# EAGLE design Schematic1 (EAGLE 6.5.0)
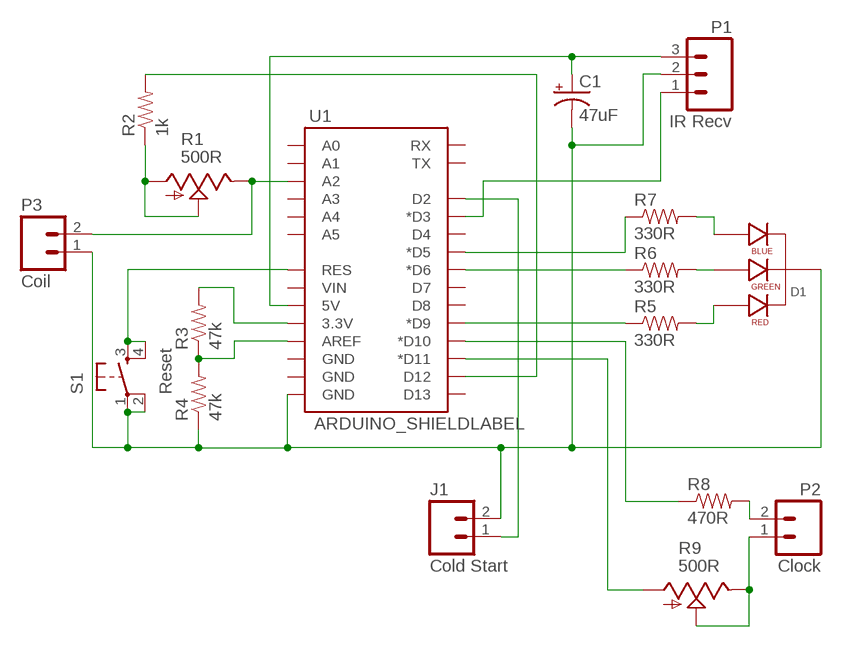
[diagram p0: schematic, sheet 1]

## Parts
C1  47uF  CAP_POLPTH2  [CPOL-RADIAL-10UF-25V]
D1  LED-RGB-CC-THRUDIFFUSE  [LED-RGB-THRU]
J1  Cold Start  M02PTH  [1X02]
P1  IR Recv  M03PTH  [1X03]
P2  Clock  M02PTH  [1X02]
P3  Coil  M02PTH  [1X02]
R1  500R  TRIM_US-ECP10P  [ECP10P]
R2  1k  10KOHM1/6W5%(PTH)KIT  [AXIAL-0.3-KIT]
R3  47k  10KOHM1/6W5%(PTH)KIT  [AXIAL-0.3-KIT]
R4  47k  10KOHM1/6W5%(PTH)KIT  [AXIAL-0.3-KIT]
R5  330R  10KOHM1/6W5%(PTH)KIT  [AXIAL-0.3-KIT]
R6  330R  10KOHM1/6W5%(PTH)KIT  [AXIAL-0.3-KIT]
R7  330R  10KOHM1/6W5%(PTH)KIT  [AXIAL-0.3-KIT]
R8  470R  10KOHM1/6W5%(PTH)KIT  [AXIAL-0.3-KIT]
R9  500R  TRIM_US-ECP10P  [ECP10P]
S1  Reset  TAC_SWITCHPTH  [TACTILE-PTH]
U1  ARDUINO_SHIELDLABEL  [DUEMILANOVE_SHIELD]

## Nets
GND: C1.2(-) D1.2(CATHODE) J1.2 P1.2 P3.1 R4.P$1 S1.1 S1.2 U1.GND@0(GND)
N$1: R5.P$1 U1.D9(*D9)
N$2: R6.P$1 U1.D6(*D6)
N$3: D1.4(BLUE_ANODE) R7.P$2
N$4: R7.P$1 U1.D5(*D5)
N$5: D1.3(GREEN_ANODE) R6.P$2
N$6: D1.1(RED_ANODE) R5.P$2
N$8: J1.1 U1.D2
N$9: P3.2 R1.E U1.A2
N$10: R2.P$2 U1.D12
N$11: R3.P$1 R4.P$2 U1.AREF
N$12: R3.P$2 U1.3.3V
N$13: R1.A R1.S R2.P$1
N$14: S1.3 S1.4 U1.RES
N$15: C1.1(+) P1.3 U1.5V
N$16: P1.1 U1.D3(*D3)
N$17: R8.P$1 U1.D10(*D10)
N$18: R9.A U1.D11(*D11)
N$19: P2.2 R8.P$2
N$20: P2.1 R9.E R9.S
Unconnected: U1.A0 U1.A1 U1.A3 U1.A4 U1.A5 U1.D4 U1.D7 U1.D8 U1.D13 U1.GND@1(GND) U1.GND@2(GND) U1.RX U1.TX U1.VIN

## Library data of the parts
C1 = SparkFun-Capacitors:CAP_POL: Capacitor Polarized These are standard SMD and PTH capacitors. Normally 10uF, 47uF, and 100uF in electrolytic and tantalum varieties. Always verify the external diameter of the through hole cap, it varies with capacity, voltage, and manufacturer. The EIA devices should be standard.
D1 = dehne:LED-RGB-CC-THRU: RGB Through-hole common cathode LED wide spacing for hand soldering; PROD_ID: DIO-09434
J1 P2 P3 = SparkFun-Connectors:M02: Standard 2-pin 0.1" header. Use with - straight break away headers ( PRT-00116) - right angle break away headers (PRT-00553) - swiss pins (PRT-00743) - machine pins (PRT-00117) - female headers (PRT-00115) Molex polarized connector foot print use with: PRT-08233 with associated crimp pins and housings. 2.54_SCREWTERM for use with PRT-10571. 3.5mm Screw Terminal footprints for PRT-08084 5mm Screw Terminal footprints for use with PRT-08433
P1 = SparkFun-Connectors:M03: Header 3 Standard 3-pin 0.1" header. Use with straight break away headers (SKU : PRT-00116), right angle break away headers (PRT-00553), swiss pins (PRT-00743), machine pins (PRT-00117), and female headers (PRT-00115). Molex polarized connector foot print use with SKU : PRT-08232 with associated crimp pins and housings.
R1 R9 = pot:TRIM_US-: POTENTIOMETER
R2-R8 = SparkFun-Resistors:10KOHM1/6W5%(PTH): RES-08375; PROD_ID: RES-08375
S1 = SparkFun-Electromechanical:TAC_SWITCH: Momentary Switch Button commonly used for reset or general input. Spark Fun Electronics SKU : COM-00097 SMT- SWCH-08247
U1 = SparkFun-Boards:ARDUINO_SHIELD: Arduino shield footprint

## Board
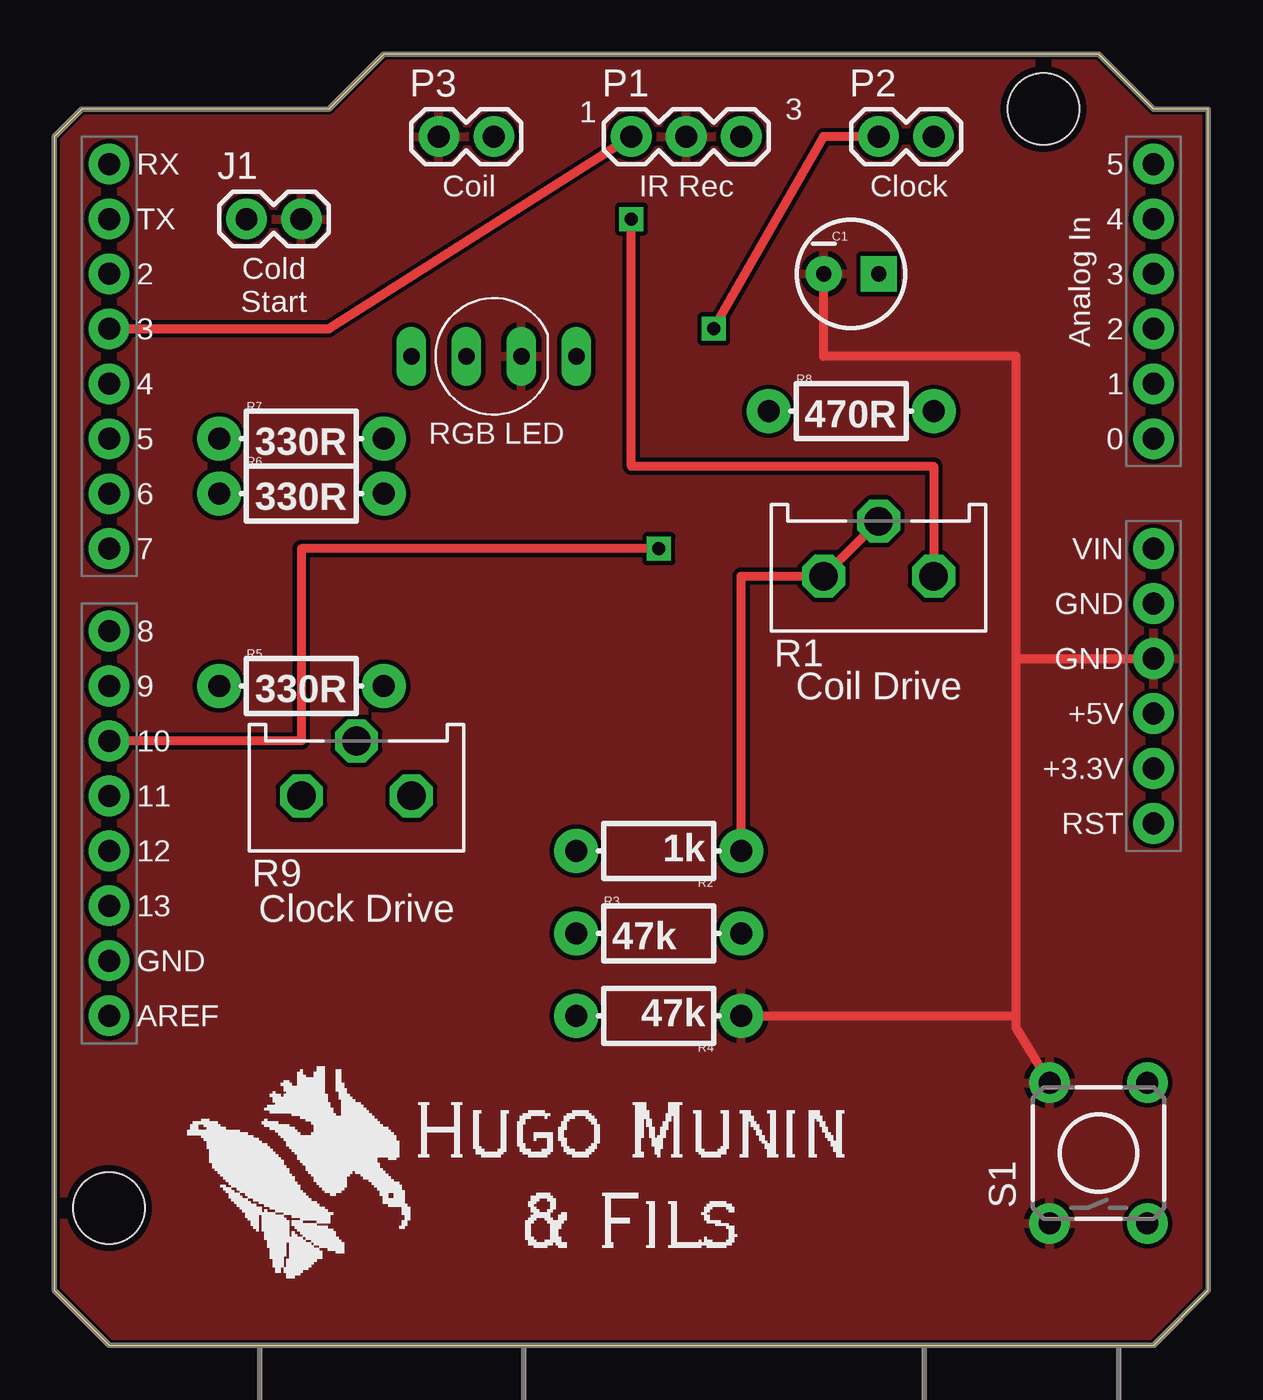
[diagram p1: board, top side]
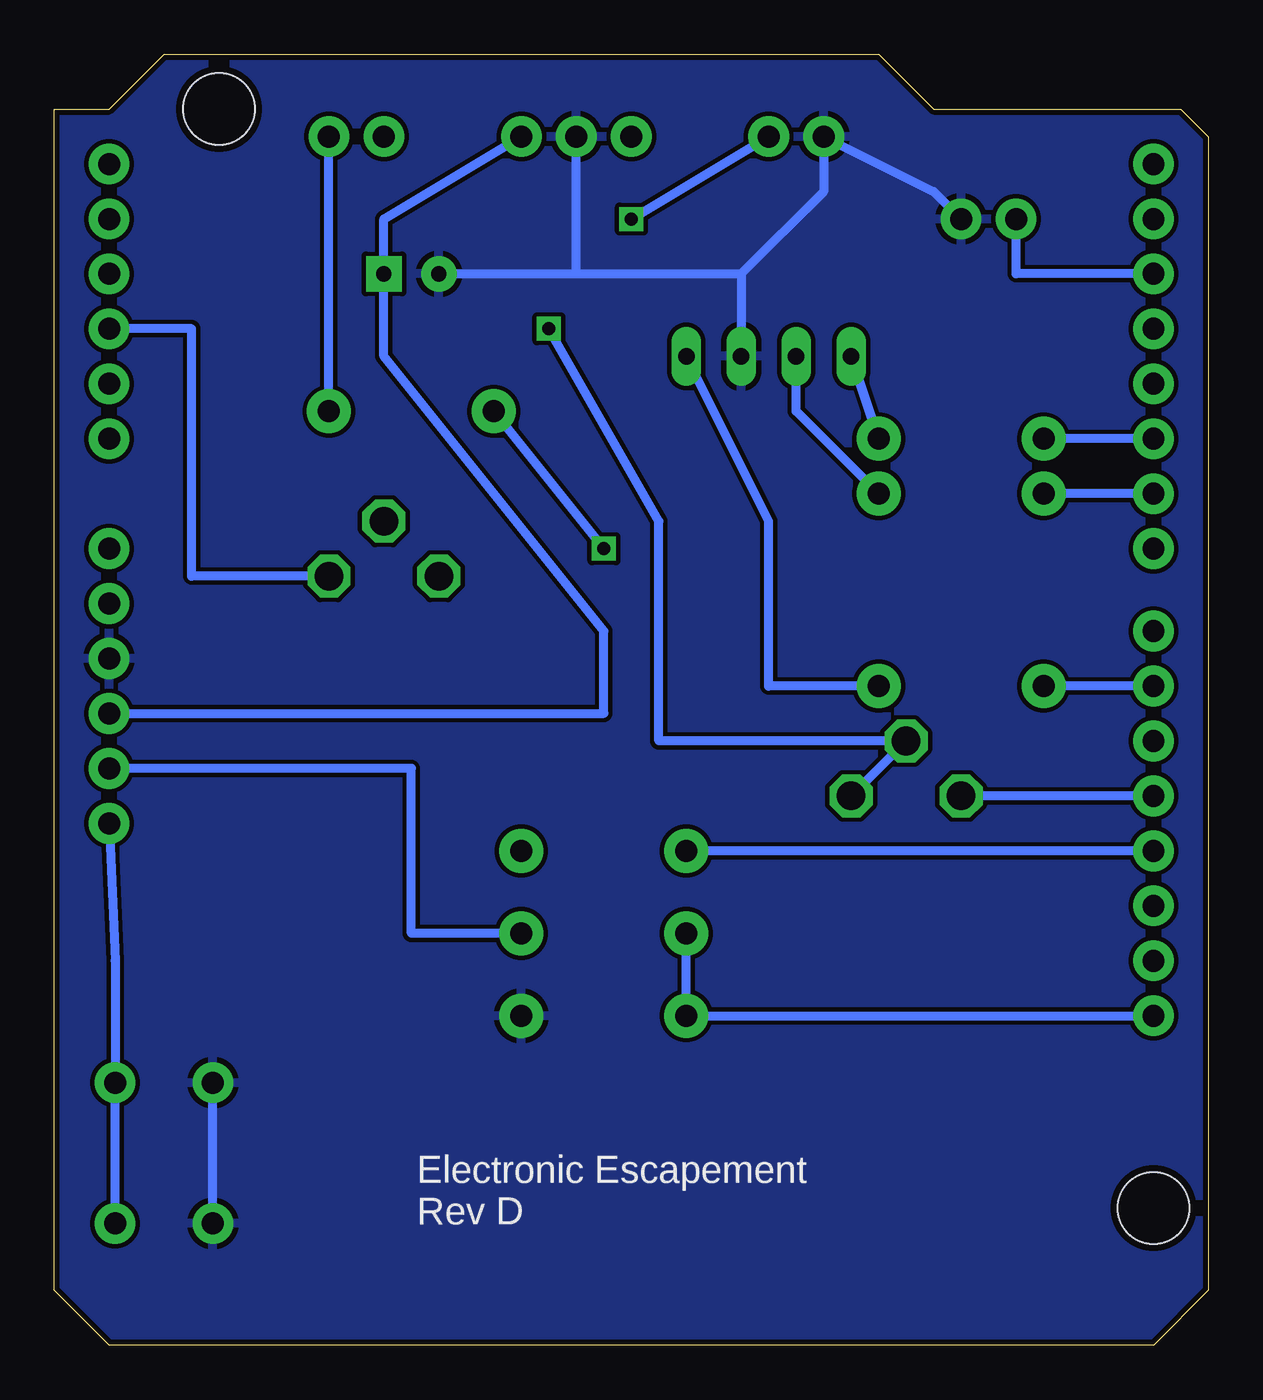
[diagram p2: board, bottom side, seen from below]

Size 53.34 x 59.69 mm. Coordinates in mm from the lower left corner, seen from the top.
Outline: 0,2.54 2.54,0 50.8,0 53.34,2.54 53.34,57.15 50.8,57.15 48.26,59.69 15.24,59.69 12.7,57.15 1.27,57.15 0,55.88 0,2.54
Copper layers (1*16): Top 0.035mm / dielectric 1.5mm / Bottom 0.035mm
Design rules "SparkFun": minimum track width 8mil, minimum drill 20mil, track to track 8mil, track to pad 8mil, pad to pad 8mil, via to via 8mil, smd to smd 8mil, copper to edge 10mil, drill to drill 8mil, minimum pad ring 12mil, minimum via ring 10mil, stop-mask expansion 4mil, vias tented up to drill 25mil, thermal gap 10mil

### Footprints (pad centres in the part's own frame; a part is rotated, then mirrored left to right if it is on the bottom)
CPOL-RADIAL-10UF-25V = drill 0.7 pad 1.651 square: 1 1.27,0 | drill 0.7 pad 1.651: 2 -1.27,0
LED-RGB-THRU = drill 0.762 pad 0.889 long: 1 3.81,0; 2 1.27,0; 3 -1.27,0; 4 -3.81,0
1X02 = drill 1.016 pad 1.88: 1 0,0; 2 2.54,0
1X03 = drill 1.016 pad 1.88: 1 0,0; 2 2.54,0; 3 5.08,0
ECP10P = drill 1.321 octagon: A -2.54,0; E 2.54,0; S 0,2.54
AXIAL-0.3-KIT = drill 1.016 pad 2.032: P$1 -3.81,0; P$2 3.81,0
TACTILE-PTH = drill 1.016 pad 1.88: 1 -3.251,2.261; 2 3.251,2.261; 3 -3.251,-2.261; 4 3.251,-2.261
DUEMILANOVE_SHIELD = drill 1.016 pad 1.88: 3.3V 50.8,26.67; 5V 50.8,29.21; A0 50.8,41.91; A1 50.8,44.45; A2 50.8,46.99; A3 50.8,49.53; A4 50.8,52.07; A5 50.8,54.61; AREF 2.54,15.24; D2 2.54,49.53; D3 2.54,46.99; D4 2.54,44.45; D5 2.54,41.91; D6 2.54,39.37; D7 2.54,36.83; D8 2.54,33.02; D9 2.54,30.48; D10 2.54,27.94; D11 2.54,25.4; D12 2.54,22.86; D13 2.54,20.32; GND@0 50.8,31.75; GND@1 50.8,34.29; GND@2 2.54,17.78; RES 50.8,24.13; RX 2.54,54.61; TX 2.54,52.07; VIN 50.8,36.83 | hole 3.302: 45.72,57.15; 2.54,6.35

### Placement (x,y rotation side)
C1  36.83,49.53 0 top
D1  20.32,45.72 0 top
J1  8.89,52.07 0 top
P1  26.67,55.88 0 top
P2  38.1,55.88 0 top
P3  17.78,55.88 0 top
R1  38.1,35.56 0 top
R2  27.94,22.86 180 top
R3  27.94,19.05 0 top
R4  27.94,15.24 180 top
R5  11.43,30.48 0 top
R6  11.43,39.37 0 top
R7  11.43,41.91 0 top
R8  36.83,43.18 0 top
R9  13.97,25.4 0 top
S1  48.26,8.89 90 top
U1  0,0 0 top

### Tracks (layer width: path | path; a pad name or v marks a point on that pad's centre or on a via)
GND
  Top 0.406: S1.2 44.45,14.68 44.45,15.24 | 44.45,15.24 44.45,31.75 | 44.45,31.75 U1.GND@0 | R4.P$1 44.45,15.24 | 44.45,31.75 44.45,45.72 35.56,45.72 C1.2
  Bottom 0.406: J1.2 12.7,53.34 P3.1 17.78,53.34 21.59,49.53 | S1.1 S1.2 | C1.2 29.21,49.53 | 29.21,49.53 P1.2 | 21.59,49.53 D1.2 | 29.21,49.53 21.59,49.53
  pour Top: 50.8,0 2.54,0 0,2.54 0,55.88 1.27,57.15 12.7,57.15 15.24,59.69 48.26,59.69 50.8,57.15 53.34,57.15 53.34,2.54
  pour Bottom: 50.8,0 2.54,0 0,2.54 0,55.88 1.27,57.15 12.7,57.15 15.24,59.69 48.26,59.69 50.8,57.15 53.34,57.15 53.34,2.54
N$1
  Bottom 0.406: U1.D9 R5.P$1
N$2
  Bottom 0.406: U1.D6 R6.P$1
N$3
  Bottom 0.406: R7.P$2 D1.4
N$4
  Bottom 0.406: U1.D5 R7.P$1
N$5
  Bottom 0.406: R6.P$2 19.05,43.18 D1.3
N$6
  Bottom 0.406: R5.P$2 20.32,30.48 20.32,38.1 D1.1
N$8
  Bottom 0.406: U1.D2 8.89,49.53 J1.1
N$9  (via drill 0.6)
  Top 0.406: R1.E 40.64,40.64 26.67,40.64 v26.67,52.07
  Bottom 0.406: R1.E 46.99,35.56 46.99,46.99 U1.A2 | v26.67,52.07 P3.2
N$10
  Bottom 0.406: U1.D12 R2.P$2
N$11
  Bottom 0.406: U1.AREF R4.P$2 R3.P$1
N$12
  Bottom 0.406: R3.P$2 36.83,19.05 36.83,26.67 U1.3.3V
N$13
  Top 0.406: R1.S R1.A 31.75,35.56 R2.P$1
N$14
  Bottom 0.406: U1.RES 50.52,17.78 S1.4 S1.3
N$15
  Bottom 0.406: U1.5V 27.94,29.21 27.94,33.02 38.1,45.72 C1.1 38.1,52.07 P1.3
N$16
  Top 0.406: U1.D3 12.7,46.99 P1.1
N$17  (via drill 0.6)
  Top 0.406: v27.94,36.83 11.43,36.83 11.43,27.94 U1.D10
  Bottom 0.406: R8.P$1 v27.94,36.83
N$18
  Bottom 0.406: U1.D11 R9.A
N$19
  Bottom 0.406: R8.P$2 P2.2
N$20  (via drill 0.6)
  Top 0.406: P2.1 35.56,55.88 v30.48,46.99
  Bottom 0.406: R9.E R9.S 25.4,27.94 25.4,38.1 v30.48,46.99

### Text on the board
tPlace: 1 | 3 | Coil Drive | Clock Drive
_tsilk: Coil | IR Rec | Clock | Cold / Start | RGB LED
_bsilk: Electronic Escapement / Rev D